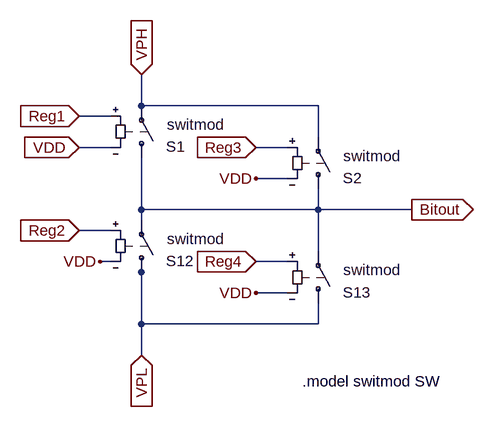
[diagram p0: schematic 2bit_PG.asc]
2bit_PG.asc, the LTspice schematic file:
Version 4
SHEET 1 3216 696
WIRE 864 -1296 864 -1344
WIRE 1136 -1296 864 -1296
WIRE 816 -1280 768 -1280
WIRE 1136 -1248 1136 -1296
WIRE 816 -1232 768 -1232
WIRE 1088 -1232 1040 -1232
WIRE 1088 -1184 1040 -1184
WIRE 864 -1136 864 -1216
WIRE 1136 -1136 1136 -1168
WIRE 1136 -1136 864 -1136
WIRE 1280 -1136 1136 -1136
WIRE 864 -1120 864 -1136
WIRE 816 -1104 768 -1104
WIRE 1136 -1072 1136 -1136
WIRE 816 -1056 800 -1056
WIRE 1088 -1056 1040 -1056
WIRE 864 -1040 864 -1056
WIRE 1088 -1008 1040 -1008
WIRE 864 -960 864 -1040
WIRE 1136 -960 1136 -992
WIRE 1136 -960 864 -960
WIRE 864 -912 864 -960
FLAG 1280 -1136 Bitout
IOPIN 1280 -1136 Out
FLAG 864 -912 VPL
IOPIN 864 -912 In
FLAG 864 -1344 VPH
IOPIN 864 -1344 In
FLAG 768 -1232 VDD
IOPIN 768 -1232 In
FLAG 768 -1280 Reg1
IOPIN 768 -1280 In
FLAG 1040 -1184 VDD
FLAG 1040 -1232 Reg3
IOPIN 1040 -1232 In
FLAG 768 -1104 Reg2
IOPIN 768 -1104 In
FLAG 1040 -1056 Reg4
IOPIN 1040 -1056 In
FLAG 1040 -1008 VDD
FLAG 800 -1056 VDD
SYMBOL sw 864 -1200 M180
WINDOW 3 24 -12 Left 0
WINDOW 38 39 67 Left 0
WINDOW 0 38 33 Left 0
SYMATTR Value ""
SYMATTR SpiceModel switmod
SYMATTR InstName S1
SYMBOL sw 1136 -1152 M180
WINDOW 3 24 -12 Left 0
WINDOW 38 39 67 Left 0
WINDOW 0 38 33 Left 0
SYMATTR Value ""
SYMATTR SpiceModel switmod
SYMATTR InstName S2
SYMBOL sw 864 -1024 M180
WINDOW 3 24 -12 Left 0
WINDOW 38 39 67 Left 0
WINDOW 0 38 33 Left 0
SYMATTR Value ""
SYMATTR SpiceModel switmod
SYMATTR InstName S12
SYMBOL sw 1136 -976 M180
WINDOW 3 24 -12 Left 0
WINDOW 38 39 67 Left 0
WINDOW 0 38 33 Left 0
SYMATTR Value ""
SYMATTR SpiceModel switmod
SYMATTR InstName S13
TEXT 1112 -872 Left 0 !.model switmod SW

The netlist it stands for:
* 2bit_PG.asc
S1 Bitout VPH Reg1 VDD switmod
S2 Bitout VPH Reg3 VDD switmod
S12 VPL Bitout Reg2 VDD switmod
S13 VPL Bitout Reg4 VDD switmod
.model switmod SW
.backanno
.end